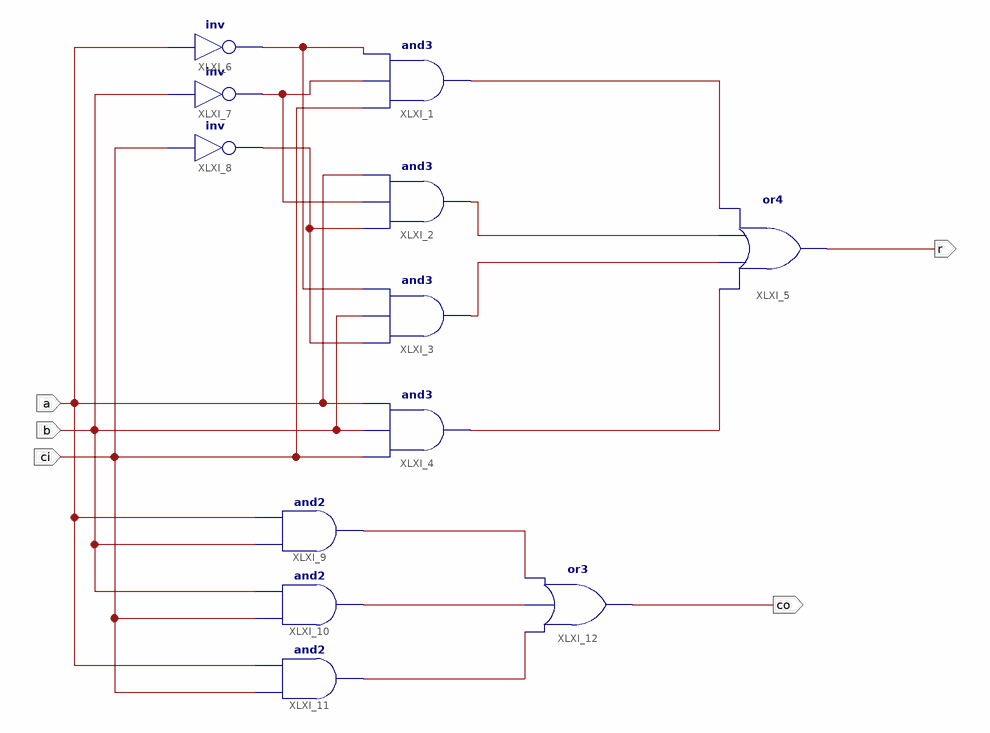
[diagram p0: schematic sheet 1]
// Xilinx ISE schematic add1b.sch (spartan3e) as structural Verilog: 12 symbols, 5 ports
module add1b (
  input  a,
  input  b,
  input  ci,
  output r,
  output co
);

  wire XLXN_2, XLXN_3, XLXN_4, XLXN_5, XLXN_24, XLXN_25, XLXN_27, XLXN_32, XLXN_33, XLXN_34;

  and XLXI_1 (XLXN_2, ci, XLXN_25, XLXN_27);
  and XLXI_2 (XLXN_3, XLXN_24, XLXN_25, a);
  and XLXI_3 (XLXN_4, XLXN_24, b, XLXN_27);
  and XLXI_4 (XLXN_5, ci, b, a);
  or XLXI_5 (r, XLXN_5, XLXN_4, XLXN_3, XLXN_2);
  not XLXI_6 (XLXN_27, a);
  not XLXI_7 (XLXN_25, b);
  not XLXI_8 (XLXN_24, ci);
  and XLXI_9 (XLXN_32, b, a);
  and XLXI_10 (XLXN_33, ci, b);
  and XLXI_11 (XLXN_34, ci, a);
  or XLXI_12 (co, XLXN_34, XLXN_33, XLXN_32);
endmodule
